# EAGLE schematic PLT-01-RevA (EAGLE 7.6.0)
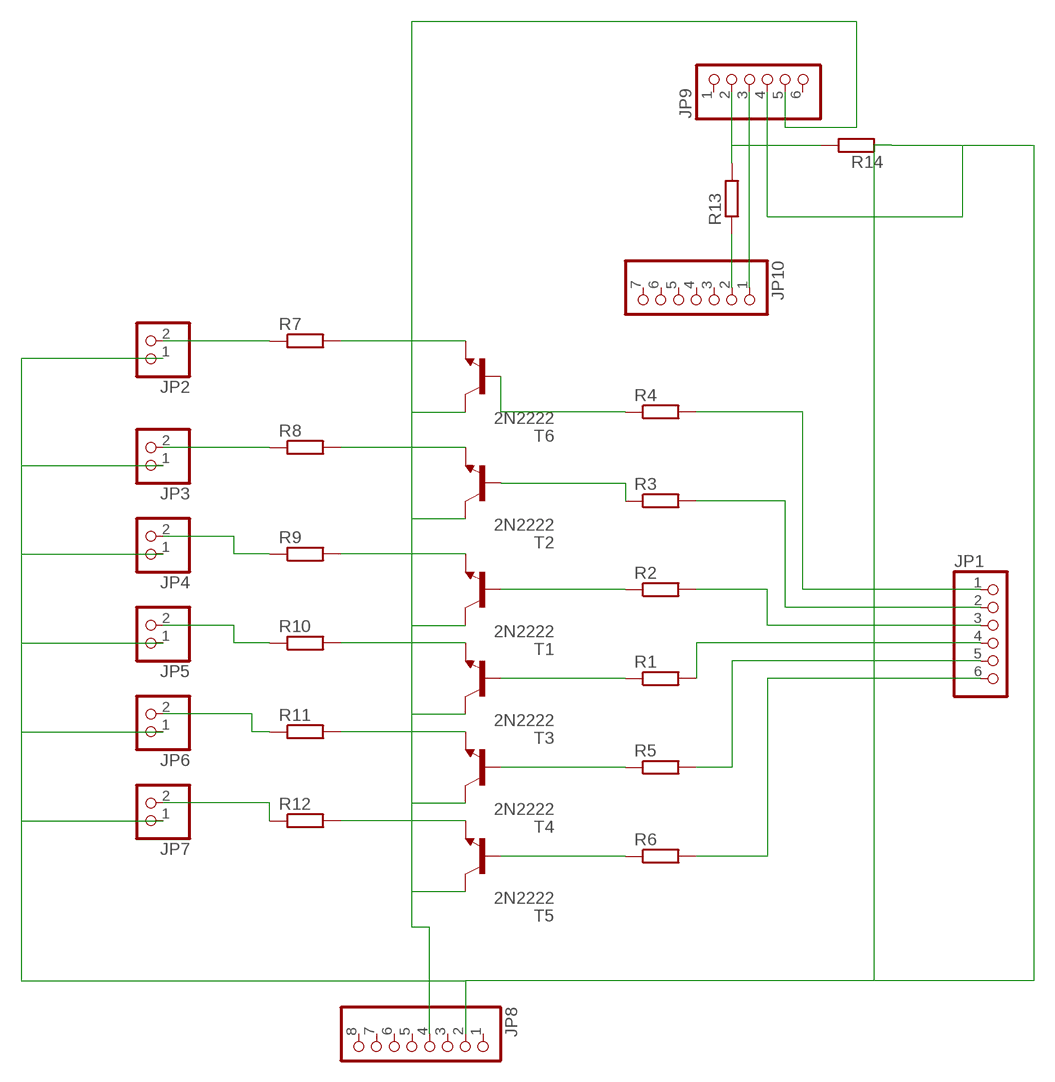
[diagram p0: schematic, sheet 1]

## Parts
JP1  PINHD-1X6  [1X06]
JP2  PINHD-1X2  [1X02]
JP3  PINHD-1X2  [1X02]
JP4  PINHD-1X2  [1X02]
JP5  PINHD-1X2  [1X02]
JP6  PINHD-1X2  [1X02]
JP7  PINHD-1X2  [1X02]
JP8  PINHD-1X8  [1X08]
JP9  PINHD-1X6  [1X06]
JP10  PINHD-1X7  [1X07]
R1  R-EU_0207/10  [0207/10]
R2  R-EU_0207/10  [0207/10]
R3  R-EU_0207/10  [0207/10]
R4  R-EU_0207/10  [0207/10]
R5  R-EU_0207/10  [0207/10]
R6  R-EU_0207/10  [0207/10]
R7  R-EU_0207/10  [0207/10]
R8  R-EU_0207/10  [0207/10]
R9  R-EU_0207/10  [0207/10]
R10  R-EU_0207/10  [0207/10]
R11  R-EU_0207/10  [0207/10]
R12  R-EU_0207/10  [0207/10]
R13  R-EU_0207/10  [0207/10]
R14  R-EU_0207/10  [0207/10]
T1  2N2222  [TO18]
T2  2N2222  [TO18]
T3  2N2222  [TO18]
T4  2N2222  [TO18]
T5  2N2222  [TO18]
T6  2N2222  [TO18]

## Nets
GND: JP2.1 JP3.1 JP4.1 JP5.1 JP6.1 JP8.2 JP9.4 R14.1
N$1: JP1.1 R4.2
N$2: JP1.2 R3.2
N$3: JP1.3 R2.2
N$4: JP1.4 R1.2
N$5: JP1.5 R5.2
N$6: JP1.6 R6.2
N$7: R6.1 T5.2(B)
N$8: R5.1 T4.2(B)
N$9: R1.1 T3.2(B)
N$10: R2.1 T1.2(B)
N$11: R3.1 T2.2(B)
N$12: R4.1 T6.2(B)
N$13: R7.2 T6.1(E)
N$14: JP2.2 R7.1
N$15: R8.2 T2.1(E)
N$16: JP3.2 R8.1
N$17: R9.2 T1.1(E)
N$18: JP4.2 R9.1
N$19: R10.2 T3.1(E)
N$20: JP5.2 R10.1
N$21: R11.2 T4.1(E)
N$22: JP6.2 R11.1
N$23: R12.2 T5.1(E)
N$24: JP7.2 R12.1
N$25: JP10.2 R13.1
N$26: JP9.2 R13.2 R14.2
N$27: JP9.3 JP10.1
N$28: JP8.4 JP9.5 T1.3(C) T2.3(C) T3.3(C) T4.3(C) T5.3(C) T6.3(C)
N$36: JP7.1
Unconnected: JP8.1 JP8.3 JP8.5 JP8.6 JP8.7 JP8.8 JP9.1 JP9.6 JP10.3 JP10.4 JP10.5 JP10.6 JP10.7

## Library data of the parts
JP1 JP9 = pinhead:PINHD-1X6: PIN HEADER
JP2-JP7 = pinhead:PINHD-1X2: PIN HEADER
JP8 = pinhead:PINHD-1X8: PIN HEADER
JP10 = pinhead:PINHD-1X7: PIN HEADER
R1-R14 = resistor:R-EU_: RESISTOR, European symbol
T1-T6 = transistor:2N2222: NPN TRANSISTOR